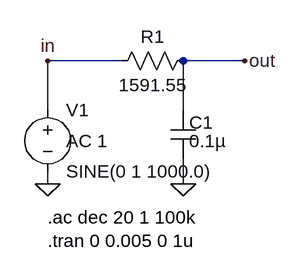
[diagram p0: schematic lowpassfilter_1khz.asc]
lowpassfilter_1khz.asc, the LTspice schematic file:
Version 4
SHEET 1 880 680
WIRE 160 96 64 96
WIRE 64 160 64 96
WIRE 240 96 240 96
WIRE 320 96 240 96
WIRE 240 160 240 96
WIRE 64 256 64 240
WIRE 240 256 240 224
FLAG 64 256 0
FLAG 240 256 0
FLAG 64 96 in
FLAG 320 96 out
SYMBOL voltage 64 144 R0
WINDOW 123 24 56 Left 2
WINDOW 39 0 0 Left 0
SYMATTR InstName V1
SYMATTR Value SINE(0 1 1000.0)
SYMATTR Value2 AC 1
SYMBOL res 256 80 R90
WINDOW 0 0 56 VBottom 2
WINDOW 3 32 56 VTop 2
SYMATTR InstName R1
SYMATTR Value 1591.55
SYMBOL cap 224 160 R0
WINDOW 0 24 16 Left 2
WINDOW 3 24 40 Left 2
SYMATTR InstName C1
SYMATTR Value 0.1µ
TEXT 64 300 Left 2 !.ac dec 20 1 100k
TEXT 64 330 Left 2 !.tran 0 0.005 0 1u

The netlist it stands for:
* lowpassfilter_1khz.asc
V1 in 0 SINE(0 1 1000.0) AC 1
R1 out in 1591.55
C1 out 0 0.1µ
.ac dec 20 1 100k
.tran 0 0.005 0 1u
.backanno
.end